# EAGLE design remote_switch (EAGLE 9.6.0)

## Sheet 1 of 2
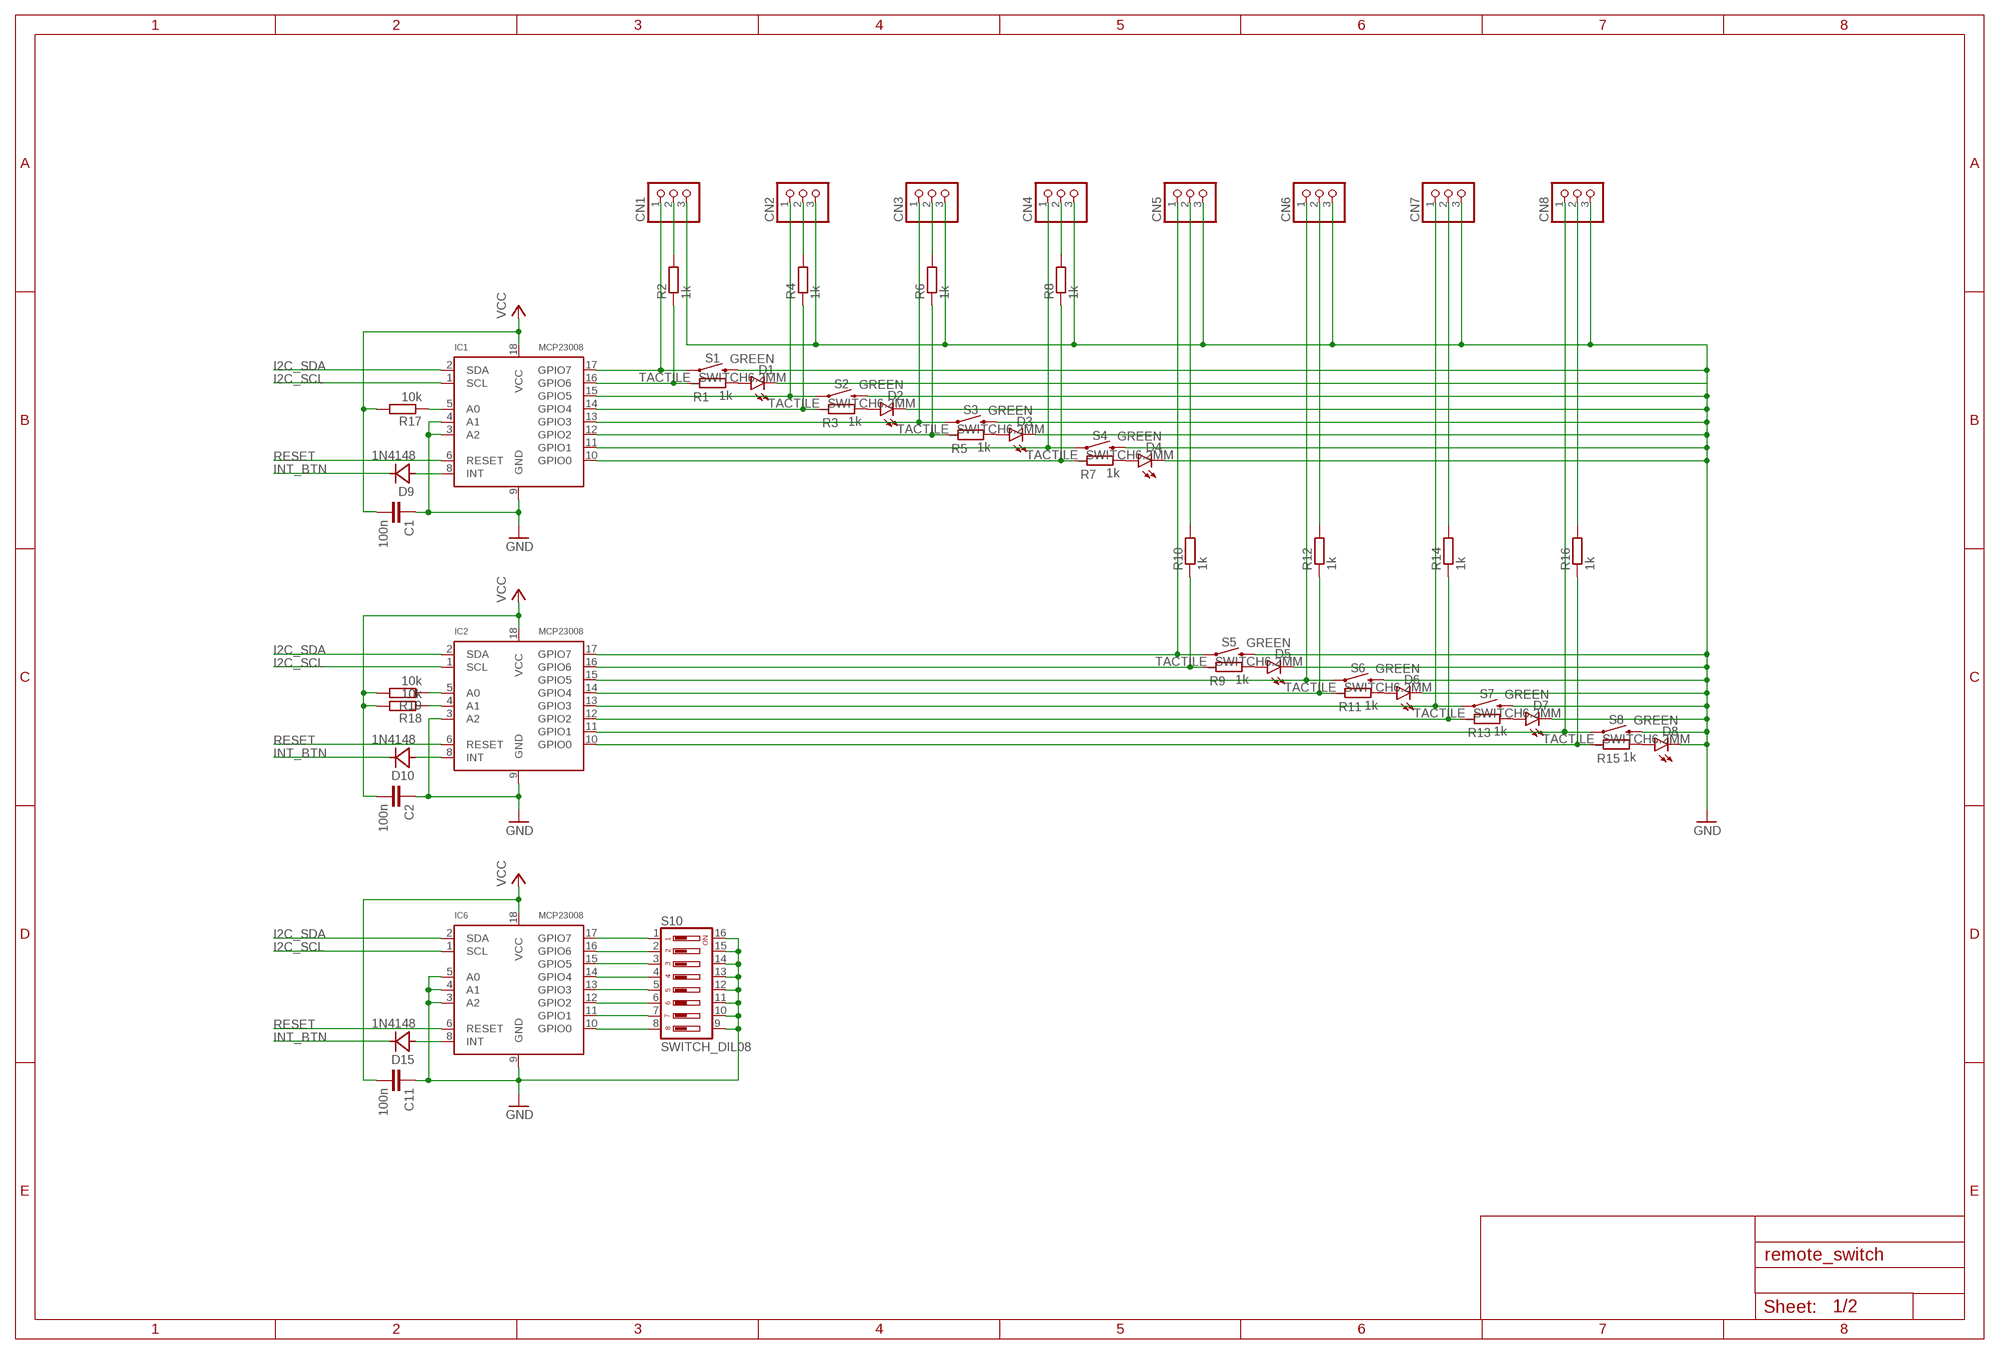
[diagram p0: schematic, sheet 1]

### Parts
C1  100n  CAPACITOR0805  [C0805]
C2  100n  CAPACITOR0805  [C0805]
C11  100n  CAPACITOR0805  [C0805]
CN1  JST_3PIN  [JSTPH3]
CN2  JST_3PIN  [JSTPH3]
CN3  JST_3PIN  [JSTPH3]
CN4  JST_3PIN  [JSTPH3]
CN5  JST_3PIN  [JSTPH3]
CN6  JST_3PIN  [JSTPH3]
CN7  JST_3PIN  [JSTPH3]
CN8  JST_3PIN  [JSTPH3]
D1  GREEN  LED1206  [CHIPLED_1206]
D2  GREEN  LED1206  [CHIPLED_1206]
D3  GREEN  LED1206  [CHIPLED_1206]
D4  GREEN  LED1206  [CHIPLED_1206]
D5  GREEN  LED1206  [CHIPLED_1206]
D6  GREEN  LED1206  [CHIPLED_1206]
D7  GREEN  LED1206  [CHIPLED_1206]
D8  GREEN  LED1206  [CHIPLED_1206]
D9  1N4148  DIODESOD-123  [SOD123]
D10  1N4148  DIODESOD-123  [SOD123]
D15  1N4148  DIODESOD-123  [SOD123]
IC1  MCP23008  MCP23008SO18W  [SO18W]
IC2  MCP23008  MCP23008SO18W  [SO18W]
IC6  MCP23008  MCP23008SO18W  [SO18W]
R1  1k  RESISTOR0805  [R0805]
R2  1k  RESISTOR0805  [R0805]
R3  1k  RESISTOR0805  [R0805]
R4  1k  RESISTOR0805  [R0805]
R5  1k  RESISTOR0805  [R0805]
R6  1k  RESISTOR0805  [R0805]
R7  1k  RESISTOR0805  [R0805]
R8  1k  RESISTOR0805  [R0805]
R9  1k  RESISTOR0805  [R0805]
R10  1k  RESISTOR0805  [R0805]
R11  1k  RESISTOR0805  [R0805]
R12  1k  RESISTOR0805  [R0805]
R13  1k  RESISTOR0805  [R0805]
R14  1k  RESISTOR0805  [R0805]
R15  1k  RESISTOR0805  [R0805]
R16  1k  RESISTOR0805  [R0805]
R17  10k  RESISTOR0805  [R0805]
R18  10k  RESISTOR0805  [R0805]
R19  10k  RESISTOR0805  [R0805]
S1  TACTILE_SWITCH6.2MM  [TACTILE_SWITCH_SMD_6.2MM]
S2  TACTILE_SWITCH6.2MM  [TACTILE_SWITCH_SMD_6.2MM]
S3  TACTILE_SWITCH6.2MM  [TACTILE_SWITCH_SMD_6.2MM]
S4  TACTILE_SWITCH6.2MM  [TACTILE_SWITCH_SMD_6.2MM]
S5  TACTILE_SWITCH6.2MM  [TACTILE_SWITCH_SMD_6.2MM]
S6  TACTILE_SWITCH6.2MM  [TACTILE_SWITCH_SMD_6.2MM]
S7  TACTILE_SWITCH6.2MM  [TACTILE_SWITCH_SMD_6.2MM]
S8  TACTILE_SWITCH6.2MM  [TACTILE_SWITCH_SMD_6.2MM]
S10  SWITCH_DIL08  [CTS-219-08]

### Nets
GND: C1.1 C2.1 C11.1 CN1.3 CN2.3 CN3.3 CN4.3 CN5.3 CN6.3 CN7.3 CN8.3 D1.C D2.C D3.C D4.C D5.C D6.C D7.C D8.C IC1.3(A2) IC1.4(A1) IC1.9(GND) IC2.3(A2) IC2.9(GND) IC6.3(A2) IC6.4(A1) IC6.5(A0) IC6.9(GND) S1.B1 S1.B2 S2.B1 S2.B2 S3.B1 S3.B2 S4.B1 S4.B2 S5.B1 S5.B2 S6.B1 S6.B2 S7.B1 S7.B2 S8.B1 S8.B2 S10.9 S10.10 S10.11 S10.12 S10.13 S10.14 S10.15 S10.16 ; also sheet 2
I2C_SCL: IC1.1(SCL) IC2.1(SCL) IC6.1(SCL) ; also sheet 2
I2C_SDA: IC1.2(SDA) IC2.2(SDA) IC6.2(SDA) ; also sheet 2
INT_BTN: D9.C D10.C D15.C ; also sheet 2
N$2: IC1.5(A0) R17.1
N$7: IC2.5(A0) R19.1
N$8: IC2.4(A1) R18.1
N$9: IC6.17(GPIO7) S10.1
N$10: IC6.16(GPIO6) S10.2
N$11: IC6.15(GPIO5) S10.3
N$12: IC6.14(GPIO4) S10.4
N$13: IC6.13(GPIO3) S10.5
N$14: IC6.12(GPIO2) S10.6
N$15: IC6.11(GPIO1) S10.7
N$25: CN1.1 IC1.17(GPIO7) S1.A1 S1.A2
N$26: CN2.1 IC1.15(GPIO5) S2.A1 S2.A2
N$27: CN3.1 IC1.13(GPIO3) S3.A1 S3.A2
N$28: CN4.1 IC1.11(GPIO1) S4.A1 S4.A2
N$29: CN5.1 IC2.17(GPIO7) S5.A1 S5.A2
N$30: CN6.1 IC2.15(GPIO5) S6.A1 S6.A2
N$31: CN7.1 IC2.13(GPIO3) S7.A1 S7.A2
N$32: CN8.1 IC2.11(GPIO1) S8.A1 S8.A2
N$33: D1.A R1.2
N$34: D2.A R3.2
N$35: D3.A R5.2
N$36: D4.A R7.2
N$37: D5.A R9.2
N$38: D6.A R11.2
N$39: D7.A R13.2
N$40: D8.A R15.2
N$41: CN1.2 R2.2
N$42: IC1.16(GPIO6) R1.1 R2.1
N$43: CN2.2 R4.2
N$44: CN3.2 R6.2
N$45: CN4.2 R8.2
N$46: CN5.2 R10.2
N$47: CN6.2 R12.2
N$48: CN7.2 R14.2
N$49: CN8.2 R16.2
N$50: IC1.14(GPIO4) R3.1 R4.1
N$51: IC1.12(GPIO2) R5.1 R6.1
N$52: IC1.10(GPIO0) R7.1 R8.1
N$53: IC2.16(GPIO6) R9.1 R10.1
N$54: IC2.14(GPIO4) R11.1 R12.1
N$55: IC2.12(GPIO2) R13.1 R14.1
N$56: IC2.10(GPIO0) R15.1 R16.1
N$57: IC6.10(GPIO0) S10.8
N$58: D10.A IC2.8(INT)
N$122: D9.A IC1.8(INT)
N$123: D15.A IC6.8(INT)
RESET: IC1.6(RESET) IC2.6(RESET) IC6.6(RESET) ; also sheet 2
VCC: C1.2 C2.2 C11.2 IC1.18(VCC) IC2.18(VCC) IC6.18(VCC) R17.2 R18.2 R19.2 ; also sheet 2

## Sheet 2 of 2
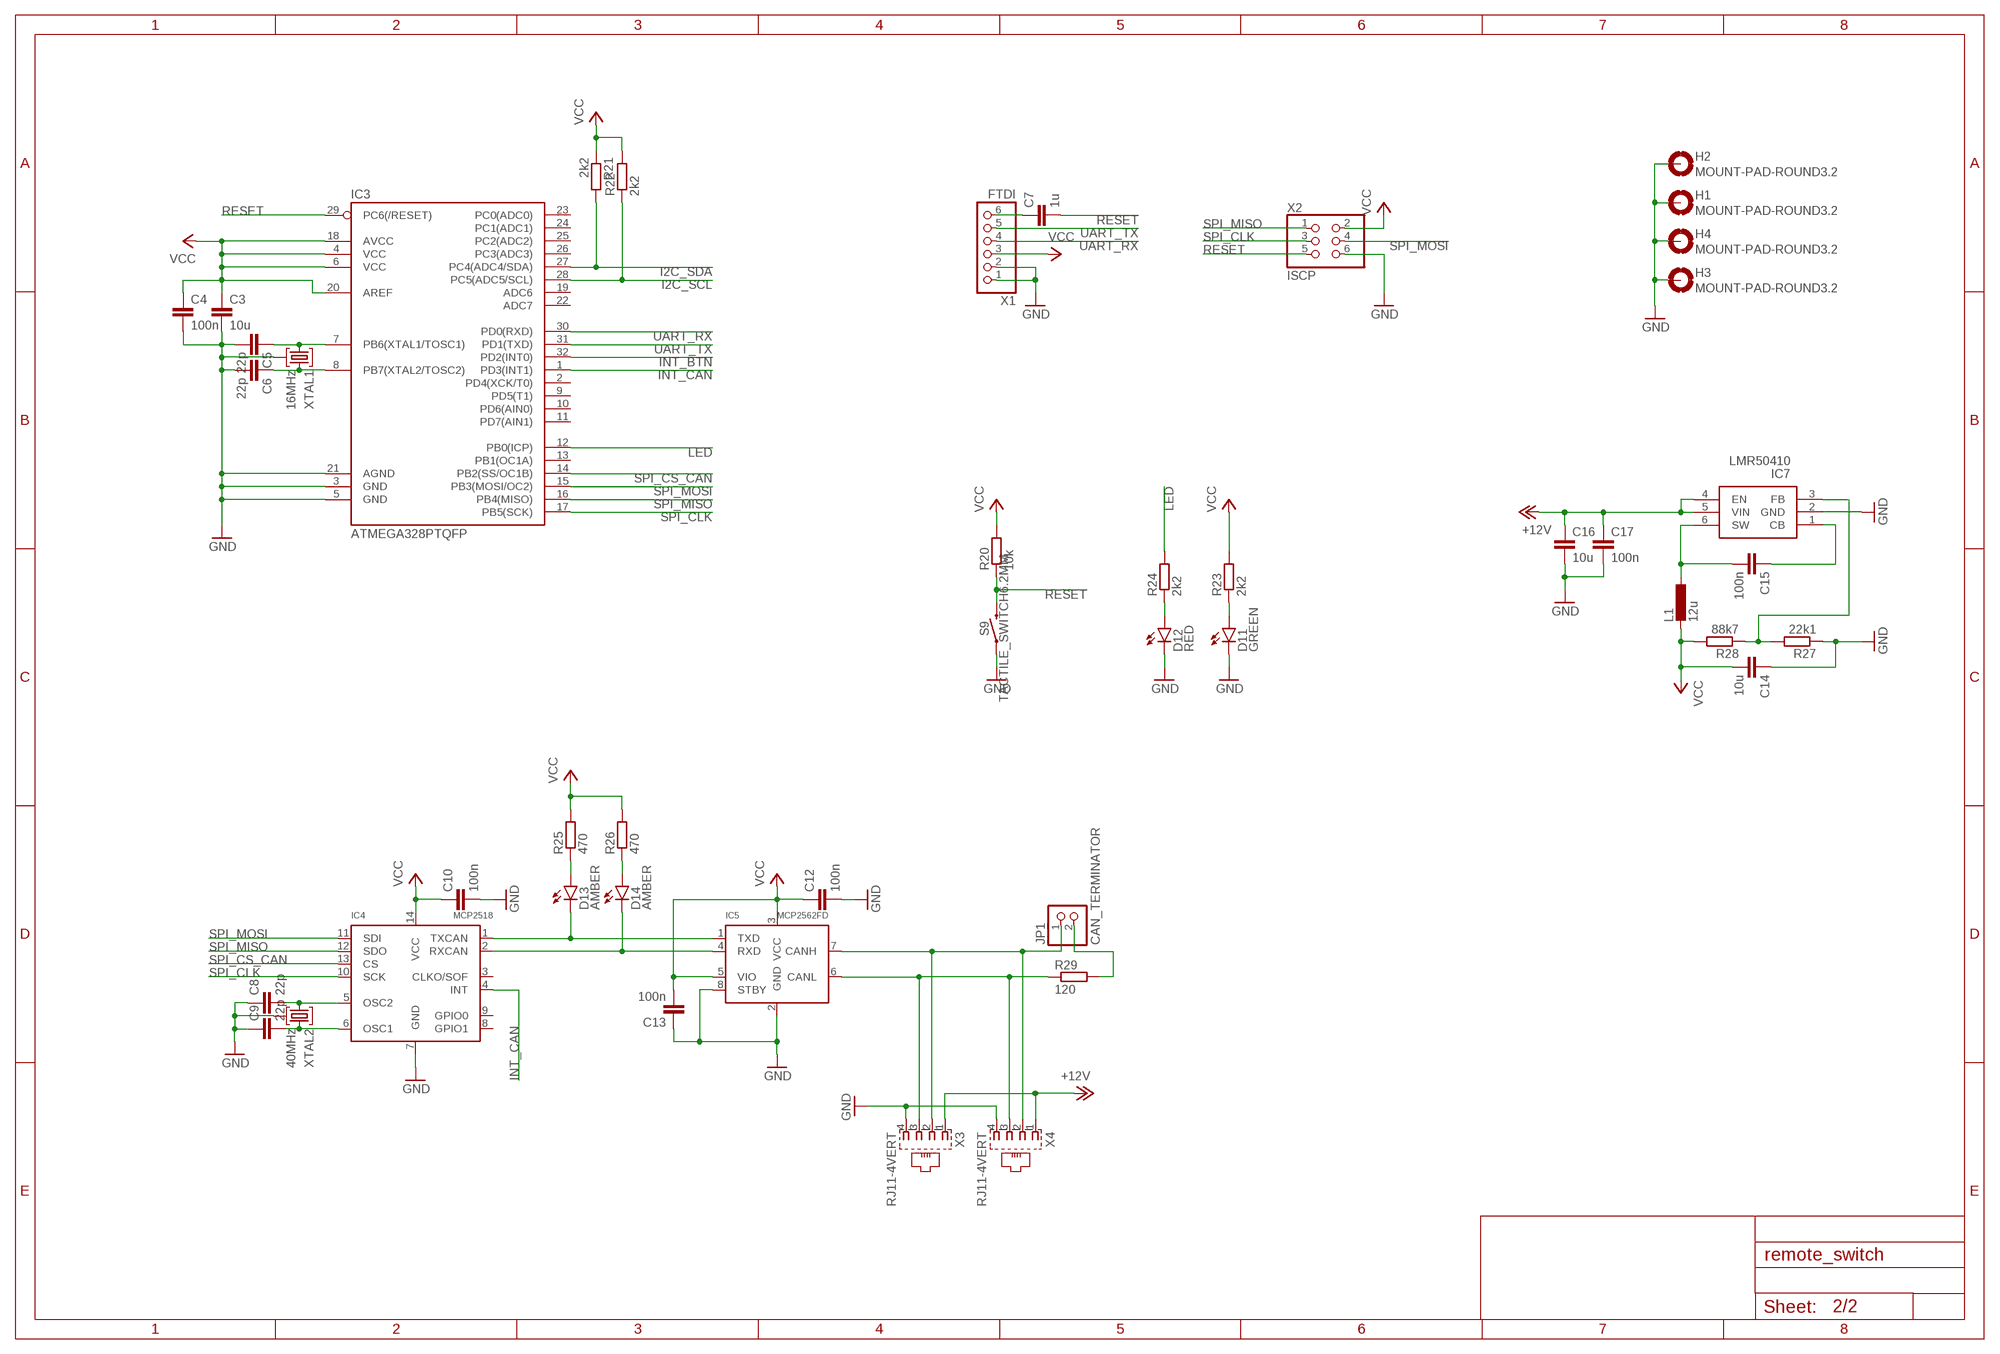
[diagram p1: schematic, sheet 2]

### Parts
C3  10u  CAPACITOR1206  [C1206]
C4  100n  CAPACITOR0805  [C0805]
C5  22p  CAPACITOR0805  [C0805]
C6  22p  CAPACITOR0805  [C0805]
C7  1u  CAPACITOR0805  [C0805]
C8  22p  CAPACITOR0805  [C0805]
C9  22p  CAPACITOR0805  [C0805]
C10  100n  CAPACITOR0805  [C0805]
C12  100n  CAPACITOR0805  [C0805]
C13  100n  CAPACITOR0805  [C0805]
C14  10u  CAPACITOR1206  [C1206]
C15  100n  CAPACITOR0805  [C0805]
C16  10u  CAPACITOR1206  [C1206]
C17  100n  CAPACITOR0805  [C0805]
D11  GREEN  LED1206  [CHIPLED_1206]
D12  RED  LED1206  [CHIPLED_1206]
D13  AMBER  LED1206  [CHIPLED_1206]
D14  AMBER  LED1206  [CHIPLED_1206]
H1  MOUNT-PAD-ROUND3.2  [3,2-PAD]
H2  MOUNT-PAD-ROUND3.2  [3,2-PAD]
H3  MOUNT-PAD-ROUND3.2  [3,2-PAD]
H4  MOUNT-PAD-ROUND3.2  [3,2-PAD]
IC3  ATMEGA328PTQFP  [TQFP32_0.8MM_7X7MM]
IC4  MCP2518  MCP2518FDSO14  [SO14]
IC5  MCP2562FD  MCP2562FDSO08  [SO08]
IC7  LMR50410  [SOT23-6]
JP1  CAN_TERMINATOR  PINHD-1X2  [1X02]
L1  12u  INDUCTOR7.3MM  [L_7.3MM]
R20  10k  RESISTOR0805  [R0805]
R21  2k2  RESISTOR0805  [R0805]
R22  2k2  RESISTOR0805  [R0805]
R23  2k2  RESISTOR0805  [R0805]
R24  2k2  RESISTOR0805  [R0805]
R25  470  RESISTOR0805  [R0805]
R26  470  RESISTOR0805  [R0805]
R27  22k1  RESISTOR0805  [R0805]
R28  88k7  RESISTOR0805  [R0805]
R29  120  RESISTOR0805  [R0805]
S9  TACTILE_SWITCH6.2MM  [TACTILE_SWITCH_SMD_6.2MM]
X1  FTDI  PINHD-1X6  [1X06]
X2  ISCP  PINHD-2X3  [2X03]
X3  RJ11-4VERT  [RJ11-4_VERT]
X4  RJ11-4VERT  [RJ11-4_VERT]
XTAL1  16MHz  CRYSTAL_GND5X3.2  [XTAL_5.0X3.2_4]
XTAL2  40MHz  CRYSTAL_GND5X3.2  [XTAL_5.0X3.2_4]

### Nets
+12V: C16.1 C17.1 IC7.4(EN) IC7.5(VIN) X3.1 X4.1
GND: C3.2 C4.2 C5.2 C6.2 C8.1 C9.1 C10.2 C12.2 C13.1 C14.1 C16.2 C17.2 D11.C D12.C H1.B3,2(MOUNT) H1.P$1(MOUNT) H1.P$2(MOUNT) H1.P$3(MOUNT) H1.P$4(MOUNT) H1.P$5(MOUNT) H1.P$6(MOUNT) H1.P$7(MOUNT) H1.P$8(MOUNT) H2.B3,2(MOUNT) H2.P$1(MOUNT) H2.P$2(MOUNT) H2.P$3(MOUNT) H2.P$4(MOUNT) H2.P$5(MOUNT) H2.P$6(MOUNT) H2.P$7(MOUNT) H2.P$8(MOUNT) H3.B3,2(MOUNT) H3.P$1(MOUNT) H3.P$2(MOUNT) H3.P$3(MOUNT) H3.P$4(MOUNT) H3.P$5(MOUNT) H3.P$6(MOUNT) H3.P$7(MOUNT) H3.P$8(MOUNT) H4.B3,2(MOUNT) H4.P$1(MOUNT) H4.P$2(MOUNT) H4.P$3(MOUNT) H4.P$4(MOUNT) H4.P$5(MOUNT) H4.P$6(MOUNT) H4.P$7(MOUNT) H4.P$8(MOUNT) IC3.3(GND) IC3.5(GND) IC3.21(AGND) IC4.7(GND) IC5.2(GND) IC5.8(STBY) IC7.2(GND) R27.1 S9.A1 S9.A2 X1.1 X1.2 X2.6 X3.4 X4.4 XTAL1.2 XTAL1.4 XTAL2.2 XTAL2.4 ; also sheet 1
I2C_SCL: IC3.28(PC5(ADC5/SCL)) R22.1 ; also sheet 1
I2C_SDA: IC3.27(PC4(ADC4/SDA)) R21.2 ; also sheet 1
INT_BTN: IC3.32(PD2(INT0)) ; also sheet 1
INT_CAN: IC3.1(PD3(INT1)) IC4.4(INT)
LED: IC3.12(PB0(ICP)) R24.2
N$1: D12.A R24.1
N$3: C5.1 IC3.7(PB6(XTAL1/TOSC1)) XTAL1.1
N$4: C6.1 IC3.8(PB7(XTAL2/TOSC2)) XTAL1.3
N$5: D11.A R23.1
N$6: C7.1 X1.6
N$16: IC5.6(CANL) R29.1 X3.3 X4.3
N$17: IC5.7(CANH) JP1.1 X3.2 X4.2
N$18: D13.C IC4.1(TXCAN) IC5.1(TXD)
N$19: D14.C IC4.2(RXCAN) IC5.4(RXD)
N$20: C8.2 IC4.5(OSC2) XTAL2.1
N$21: C9.2 IC4.6(OSC1) XTAL2.3
N$22: D13.A R25.1
N$23: D14.A R26.1
N$24: JP1.2 R29.2
N$125: C15.2 IC7.6(SW) L1.1
N$126: C15.1 IC7.1(CB)
N$127: IC7.3(FB) R27.2 R28.1
RESET: C7.2 IC3.29(PC6(/RESET)) R20.1 S9.B1 S9.B2 X2.5 ; also sheet 1
SPI_CLK: IC3.17(PB5(SCK)) IC4.10(SCK) X2.3
SPI_CS_CAN: IC3.14(PB2(SS/OC1B)) IC4.13(CS)
SPI_MISO: IC3.16(PB4(MISO)) IC4.12(SDO) X2.1
SPI_MOSI: IC3.15(PB3(MOSI/OC2)) IC4.11(SDI) X2.4
UART_RX: IC3.30(PD0(RXD)) X1.4
UART_TX: IC3.31(PD1(TXD)) X1.5
VCC: C3.1 C4.1 C10.1 C12.1 C13.2 C14.2 IC3.4(VCC) IC3.6(VCC) IC3.18(AVCC) IC3.20(AREF) IC4.14(VCC) IC5.3(VCC) IC5.5(VIO) L1.2 R20.2 R21.1 R22.2 R23.2 R25.2 R26.2 R28.2 X1.3 X2.2 ; also sheet 1
Unconnected: IC3.2(PD4(XCK/T0)) IC3.9(PD5(T1)) IC3.10(PD6(AIN0)) IC3.11(PD7(AIN1)) IC3.13(PB1(OC1A)) IC3.19(ADC6) IC3.22(ADC7) IC3.23(PC0(ADC0)) IC3.24(PC1(ADC1)) IC3.25(PC2(ADC2)) IC3.26(PC3(ADC3)) IC4.3(CLKO/SOF) IC4.8(GPIO1) IC4.9(GPIO0)

## Library data of the parts
C1-C17 = SMD:CAPACITOR
CN1-CN8 = SMD:JST_3PIN
D1-D8 D11-D14 = SMD:LED
D9 D10 D15 = SMD:DIODE
H1-H4 = THT:MOUNT-PAD-ROUND: MOUNTING PAD, round
IC1 IC2 IC6 = SMD:MCP23008
IC3 = SMD:ATMEGA328P
IC4 = SMD:MCP2518FD
IC5 = SMD:MCP2562FD
IC7 = SMD:LMR50410
JP1 = THT:PINHD-1X2: PIN HEADER
L1 = SMD:INDUCTOR
R1-R29 = SMD:RESISTOR
S1-S9 = SMD:TACTILE_SWITCH
S10 = SMD:SWITCH_DIL08: Surface Mount DIP Switch Series 219 SMT CTS Electronic Components Sourc: www.ctscorp.com; OC_FARNELL: unknown; OC_NEWARK: unknown
X1 = THT:PINHD-1X6: PIN HEADER
X2 = THT:PINHD-2X3: PIN HEADER
X3 X4 = THT:RJ11-4
XTAL1 XTAL2 = SMD:CRYSTAL_GND

## Board
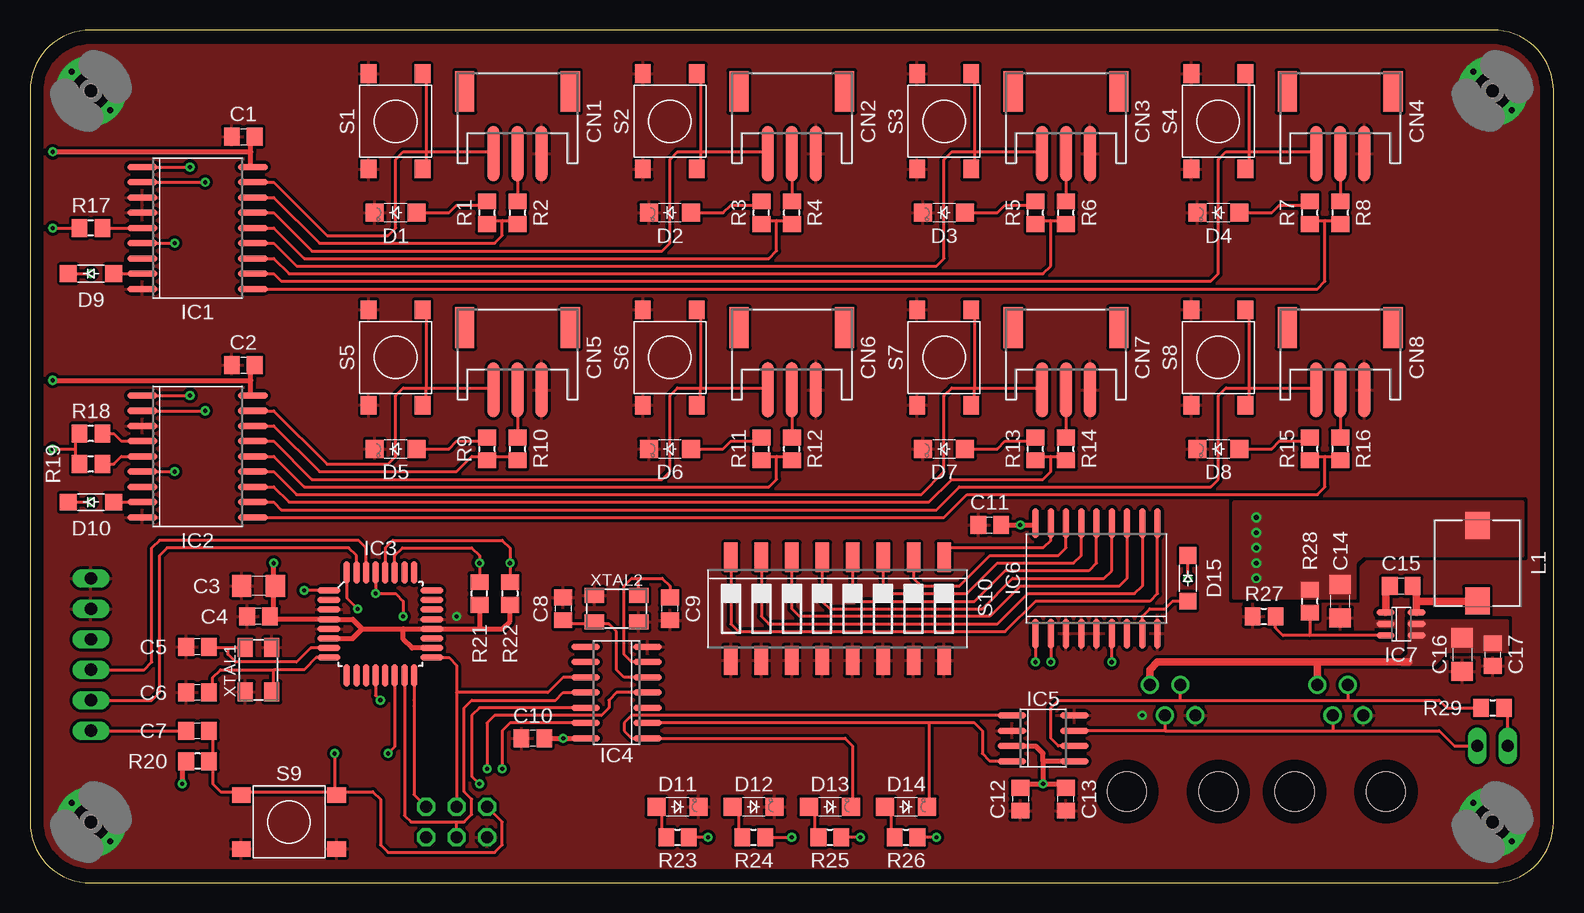
[diagram p2: board, top side]
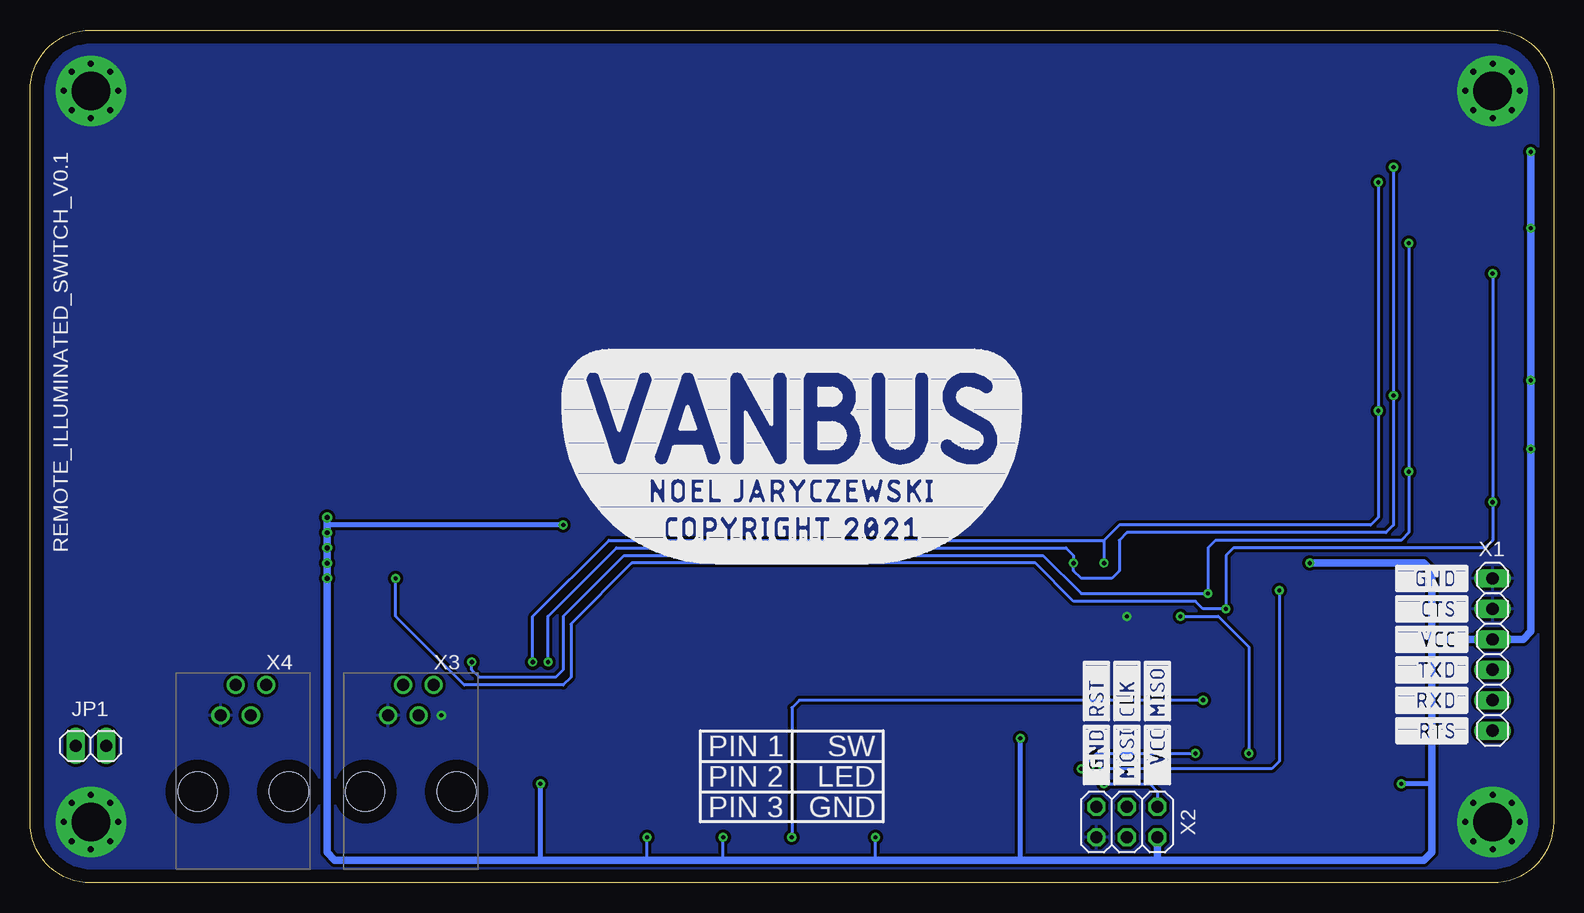
[diagram p3: board, bottom side, seen from below]

Size 127 x 71.12 mm. Coordinates in mm from the lower left corner, seen from the top.
Outline: 0,66.04 0,5.08 arc90 5.08,0 121.92,0 arc90 127,5.08 127,66.04 arc90 121.92,71.12 5.08,71.12 arc90 0,66.04
Copper layers (1*16): Top 0.035mm / dielectric 1.5mm / Bottom 0.035mm
Design rules "default *": minimum track width 6mil, minimum drill 0.35mm, track to track 8mil, track to pad 8mil, pad to pad 8mil, via to via 8mil, smd to smd 8mil, copper to edge 40mil, drill to drill 6mil, minimum pad ring 10mil, minimum via ring 8mil, stop-mask expansion 4mil, vias tented up to drill 16mil, thermal gap 10mil

### Footprints (pad centres in the part's own frame; a part is rotated, then mirrored left to right if it is on the bottom)
C0805 = smd 1.3 x 1.5: 1 -0.95,0; 2 0.95,0
C1206 = smd 1.6 x 1.8: 1 -1.4,0; 2 1.4,0
JSTPH3 = smd 1 x 4.6: 1 -2,-2.7; 2 0,-2.7; 3 2,-2.7 | smd 1.6 x 3.4: NC1 -4.4,2.5; NC2 4.4,2.5
CHIPLED_1206 = smd 1.5 x 1.5: A 0,-1.75; C 0,1.75
SOD123 = smd 1.4 x 1.4: A 1.9,0; C -1.9,0
3,2-PAD = drill 3.2 pad 5.842: B3,2 0,0 | drill 0.5: P$1 0,2.261; P$2 0,-2.261; P$3 2.261,0; P$4 -2.261,0; P$5 -1.598,1.598; P$6 1.598,1.598; P$7 -1.598,-1.598; P$8 1.598,-1.598
SO18W = smd 0.559 x 2.515: 1 -5.08,-4.6; 2 -3.81,-4.6; 3 -2.54,-4.6; 4 -1.27,-4.6; 5 0,-4.6; 6 1.27,-4.6; 7 2.54,-4.6; 8 3.81,-4.6; 9 5.08,-4.6; 10 5.08,4.6; 11 3.81,4.6; 12 2.54,4.6; 13 1.27,4.6; 14 0,4.6; 15 -1.27,4.6; 16 -2.54,4.6; 17 -3.81,4.6; 18 -5.08,4.6
TQFP32_0.8MM_7X7MM = smd 1.905 x 0.559: 1 -4.293,2.8; 2 -4.293,2; 3 -4.293,1.2; 4 -4.293,0.4; 5 -4.293,-0.4; 6 -4.293,-1.2; 7 -4.293,-2; 8 -4.293,-2.8; 17 4.293,-2.8; 18 4.293,-2; 19 4.293,-1.2; 20 4.293,-0.4; 21 4.293,0.4; 22 4.293,1.2; 23 4.293,2; 24 4.293,2.8 | smd 0.559 x 1.905: 9 -2.8,-4.293; 10 -2,-4.293; 11 -1.2,-4.293; 12 -0.4,-4.293; 13 0.4,-4.293; 14 1.2,-4.293; 15 2,-4.293; 16 2.8,-4.293; 25 2.8,4.293; 26 2,4.293; 27 1.2,4.293; 28 0.4,4.293; 29 -0.4,4.293; 30 -1.2,4.293; 31 -2,4.293; 32 -2.8,4.293
SO14 = smd 0.559 x 2.388: 1 -3.81,-2.6; 2 -2.54,-2.6; 3 -1.27,-2.6; 4 0,-2.6; 5 1.27,-2.6; 6 2.54,-2.6; 7 3.81,-2.6; 8 3.81,2.6; 9 2.54,2.6; 10 1.27,2.6; 11 0,2.6; 12 -1.27,2.6; 13 -2.54,2.6; 14 -3.81,2.6
SO08 = smd 0.559 x 2.388: 1 -1.905,-2.6; 2 -0.635,-2.6; 3 0.635,-2.6; 4 1.905,-2.6; 5 1.905,2.6; 6 0.635,2.6; 7 -0.635,2.6; 8 -1.905,2.6
SOT23-6 = smd 0.559 x 1.524: 1 0.95,1.3; 2 0,1.3; 3 -0.95,1.3; 4 -0.95,-1.3; 5 0,-1.3; 6 0.95,-1.3
1X02 = drill 1.016 long: 1 -1.27,0; 2 1.27,0
L_7.3MM = smd 2.25 x 2.05: 1 -3.15,0; 2 3.15,0
R0805 = smd 1.3 x 1.5: 1 -0.95,0; 2 0.95,0
TACTILE_SWITCH_SMD_6.2MM = smd 1.55 x 1.3: A1 -3.975,-2.25; A2 3.975,-2.25; B1 -3.975,2.25; B2 3.975,2.25
CTS-219-08 = smd 1.13 x 2.44: 1 -8.89,-4.3; 2 -6.35,-4.3; 3 -3.81,-4.3; 4 -1.27,-4.3; 5 1.27,-4.3; 6 3.81,-4.3; 7 6.35,-4.3; 8 8.89,-4.3; 9 8.89,4.3; 10 6.35,4.3; 11 3.81,4.3; 12 1.27,4.3; 13 -1.27,4.3; 14 -3.81,4.3; 15 -6.35,4.3; 16 -8.89,4.3
1X06 = drill 1.016 long: 1 -6.35,0; 2 -3.81,0; 3 -1.27,0; 4 1.27,0; 5 3.81,0; 6 6.35,0
2X03 = drill 1.016 octagon: 1 -2.54,-1.27; 2 -2.54,1.27; 3 0,-1.27; 4 0,1.27; 5 2.54,-1.27; 6 2.54,1.27
RJ11-4_VERT = drill 1: 1 -1.905,-8.89; 2 -0.635,-6.35; 3 0.635,-8.89; 4 1.905,-6.35 | hole 3.25: -3.81,0; 3.81,0
XTAL_5.0X3.2_4 = smd 1.6 x 1.25: 1 -1.85,-1.1; 2 1.85,-1.1; 3 1.85,1.1; 4 -1.85,1.1

### Placement (x,y rotation side)
C1  17.78,62.23 0 top
C2  17.78,43.18 0 top
C3  19.05,24.77 180 top
C4  19.05,22.23 180 top
C5  13.97,19.68 180 top
C6  13.97,15.88 180 top
C7  13.97,12.7 0 top
C8  44.45,22.86 270 top
C9  53.34,22.86 90 top
C10  41.91,12.06 180 top
C11  80.01,29.84 0 top
C12  82.55,6.99 270 top
C13  86.36,6.99 90 top
C14  109.22,23.5 90 top
C15  114.3,24.77 0 top
C16  119.38,19.05 270 top
C17  121.92,19.05 270 top
CN1  40.64,63.5 0 top
CN2  63.5,63.5 0 top
CN3  86.36,63.5 0 top
CN4  109.22,63.5 0 top
CN5  40.64,43.81 0 top
CN6  63.5,43.81 0 top
CN7  86.36,43.81 0 top
CN8  109.22,43.81 0 top
D1  30.48,55.88 90 top
D2  53.34,55.88 90 top
D3  76.2,55.88 90 top
D4  99.06,55.88 90 top
D5  30.48,36.2 90 top
D6  53.34,36.2 90 top
D7  76.2,36.2 90 top
D8  99.06,36.2 90 top
D9  5.08,50.8 0 top
D10  5.08,31.75 0 top
D11  53.98,6.35 270 top
D12  60.33,6.35 270 top
D13  66.67,6.35 270 top
D14  73.03,6.35 270 top
D15  96.52,25.4 270 top
H1  5.08,66.04 0 top
H2  121.92,66.04 0 top
H3  5.08,5.08 0 top
H4  121.92,5.08 0 top
IC1  13.97,54.61 270 top
IC2  13.97,35.56 270 top
IC3  29.21,21.59 0 top
IC4  48.9,15.88 90 top
IC5  84.45,12.06 270 top
IC6  88.9,25.4 0 top
IC7  114.3,21.59 90 top
JP1  121.92,11.43 180 bottom
L1  120.65,26.67 90 top
R1  38.1,55.88 90 top
R2  40.64,55.88 90 top
R3  60.96,55.88 90 top
R4  63.5,55.88 90 top
R5  83.82,55.88 90 top
R6  86.36,55.88 90 top
R7  106.68,55.88 90 top
R8  109.22,55.88 90 top
R9  38.1,36.2 90 top
R10  40.64,36.2 90 top
R11  60.96,36.2 90 top
R12  63.5,36.2 90 top
R13  83.82,36.2 90 top
R14  86.36,36.2 90 top
R15  106.68,36.2 90 top
R16  109.22,36.2 90 top
R17  5.08,54.61 180 top
R18  5.08,37.47 180 top
R19  5.08,34.92 180 top
R20  13.97,10.16 180 top
R21  37.47,24.13 90 top
R22  40.01,24.13 270 top
R23  53.98,3.81 0 top
R24  60.33,3.81 0 top
R25  66.67,3.81 0 top
R26  73.03,3.81 0 top
R27  102.87,22.23 0 top
R28  106.68,23.5 90 top
R29  121.92,14.61 0 top
S1  30.48,63.5 90 top
S2  53.34,63.5 90 top
S3  76.2,63.5 90 top
S4  99.06,63.5 90 top
S5  30.48,43.81 90 top
S6  53.34,43.81 90 top
S7  76.2,43.81 90 top
S8  99.06,43.81 90 top
S9  21.59,5.08 0 top
S10  67.31,22.86 180 top
X1  5.08,19.05 270 bottom
X2  35.56,5.08 180 bottom
X3  95.25,7.62 180 bottom
X4  109.22,7.62 180 bottom
XTAL1  19.05,17.78 270 top
XTAL2  48.9,22.86 0 top

### Tracks (layer width: path | path; a pad name or v marks a point on that pad's centre or on a via)
+12V
  Top 0.61: X3.1 93.34,17.78 93.98,18.41 107.31,18.41 | X4.1 107.31,18.41 | C17.1 122.23,19.68 | 107.31,18.41 114.94,18.41
  pour Top (isolate 0.254, no thermals): 114.94,21.84 114.94,19.05 114.3,18.41 114.3,18.24 117.09,18.24 118.16,19.3 123.19,19.3 123.19,21.84
GND  (via drill 0.35)
  other vias: 92.71,13.97 35.56,22.23
  pour Top (isolate 0.254, rank 2): 125.73,66.04 125.73,5.08 arc-90 121.92,1.27 5.08,1.27 arc-90 1.27,5.08 1.27,66.04 arc-90 5.08,69.85 121.92,69.85 arc-90
  pour Bottom (isolate 0.254, rank 2): 1.27,5.08 1.27,66.04 arc-90 5.08,69.85 121.92,69.85 arc-90 125.73,66.04 125.73,5.08 arc-90 121.92,1.27 5.08,1.27 arc-90
  pour Top (no thermals): 111.76,21.84 114.3,21.84 114.3,21.34 111.76,21.34
I2C_SCL  (via drill 0.35)
  Top 0.254: R22.1 v40.01,26.67 40.01,27.94 39.37,28.57 30.25,28.57 29.61,27.94 IC3.28 | IC6.1 v83.82,18.41 | IC1.1 v13.34,59.69 | IC2.1 v13.34,40.64
  Bottom 0.254: v83.82,18.41 83.82,22.23 78.11,27.94 40.64,27.94 40.01,27.3 v40.01,26.67 40.01,26.04 39.37,25.4 36.83,25.4 36.2,26.04 36.2,28.57 35.56,29.21 13.97,29.21 13.34,29.84 v13.34,40.64 v13.34,59.69
I2C_SDA  (via drill 0.35)
  Top 0.254: IC3.27 30.41,27.3 31.05,27.94 36.83,27.94 37.47,27.3 v37.47,26.67 R21.2 | IC6.2 v85.09,18.41 | IC1.2 v14.61,58.42 | IC2.2 v14.61,39.37
  Bottom 0.254: v85.09,18.41 85.09,22.23 78.74,28.57 37.47,28.57 | 37.47,28.57 v37.47,26.67 | v14.61,58.42 v14.61,39.37 14.61,30.48 15.24,29.84 36.2,29.84 37.47,28.57
INT_BTN  (via drill 0.35)
  Top 0.254: v96.52,25.4 D15.C | D9.C v5.08,50.8 | D10.C v5.08,31.75 | IC3.32 26.41,23.75 v27.3,22.86
  Bottom 0.254: v96.52,25.4 96.52,22.23 90.81,16.51 82.55,16.51 81.92,17.14 81.92,21.59 76.83,26.67 43.18,26.67 40.01,23.5 29.84,23.5 29.21,22.86 v27.3,22.86 27.3,27.3 26.67,27.94 5.71,27.94 5.08,28.57 v5.08,31.75 v5.08,50.8
INT_CAN  (via drill 0.35)
  Top 0.254: IC3.1 v22.86,24.39 | IC4.4 48.9,15.88 48.26,15.24 48.26,14.61 47.62,13.97 38.73,13.97 38.1,13.34 v38.1,9.53
  Bottom 0.254: v22.86,24.39 22.86,10.16 23.5,9.53 v38.1,9.53
LED  (via drill 0.35)
  Top 0.254: IC3.12 28.81,15.64 v29.21,15.24 | R24.2 v63.5,3.81
  Bottom 0.254: v29.21,15.24 62.87,15.24 63.5,14.61 v63.5,3.81
N$1
  Top 0.254: D12.A 59.05,5.87 59.05,4.13 R24.1
N$2
  Top 0.254: R17.1 IC1.5
N$3
  Top 0.254: C5.1 14.97,19.63 16.51,19.63 | 16.51,19.63 XTAL1.1 | IC3.7 23.4,19.59 22.23,18.41 17.14,18.41 16.51,19.05 16.51,19.63
N$4
  Top 0.254: C6.1 14.92,16.19 15.24,16.51 15.24,17.14 15.88,17.78 20.32,17.78 | XTAL1.3 20.15,16.34 20.32,16.51 20.32,17.78 | IC3.8 23.87,18.79 22.86,17.78 20.32,17.78
N$5
  Top 0.254: R23.1 52.7,4.13 52.7,5.87 D11.A
N$6
  Top 0.254: X1.6 C7.1
N$7
  Top 0.254: R19.1 6.99,34.92 7.62,35.56 IC2.5
N$8
  Top 0.254: R18.1 6.99,37.47 7.62,36.83 IC2.4
N$9
  Top 0.254: IC6.17 85.09,28.57 84.45,27.94 76.2,27.94 S10.1
N$10
  Top 0.254: S10.2 73.66,25.4 74.3,24.77 77.47,24.77 80.01,27.3 85.72,27.3 86.36,27.94 IC6.16
N$11
  Top 0.254: S10.3 71.12,24.77 71.75,24.13 78.11,24.13 80.64,26.67 87,26.67 87.63,27.3 IC6.15
N$12
  Top 0.254: S10.4 68.58,24.13 69.22,23.5 78.74,23.5 81.28,26.04 88.27,26.04 88.9,26.67 IC6.14
N$13
  Top 0.254: S10.5 66.04,23.5 66.67,22.86 79.38,22.86 81.92,25.4 89.53,25.4 90.17,26.04 IC6.13
N$14
  Top 0.254: IC6.12 91.44,25.4 90.81,24.77 82.55,24.77 80.01,22.23 64.14,22.23 63.5,22.86 S10.6
N$15
  Top 0.254: IC6.11 92.71,24.77 92.08,24.13 83.19,24.13 80.64,21.59 61.59,21.59 60.96,22.23 S10.7
N$16
  Top 0.254: 95.89,15.24 109.86,15.24 | X4.3 109.86,15.24 | IC5.6 85.72,11.43 85.09,12.06 85.09,14.61 85.72,15.24 95.89,15.24 | 95.89,15.24 X3.3 | 109.86,15.24 117.47,15.24 118.11,14.61 R29.1
N$17
  Top 0.254: X4.2 108.58,12.7 | 108.58,12.7 117.47,12.7 118.75,11.43 JP1.1 | X3.2 94.61,12.7 | 94.61,12.7 108.58,12.7 | 94.61,12.7 IC5.7
N$18
  Top 0.254: IC5.1 50.16,13.97 49.53,13.34 49.53,12.7 50.16,12.06 IC4.1 67.94,12.06 68.58,11.43 68.58,6.5 D13.C
N$19
  Top 0.254: IC5.4 80.01,10.16 79.38,10.79 79.38,12.7 78.74,13.34 74.93,13.34 | 74.93,13.34 IC4.2 | D14.C 74.93,6.5 74.93,13.34
N$20
  Top 0.254: IC4.5 49.53,17.14 48.9,17.78 48.9,20.95 48.26,21.59 47.22,21.59 XTAL2.1 46.88,21.59 44.77,21.59 C8.2
N$21
  Top 0.254: IC4.6 50.16,18.41 49.53,19.05 49.53,24.77 50.16,25.4 50.8,25.4 | 50.8,25.4 52.7,25.4 53.34,24.77 C9.2 | XTAL2.3 50.74,25.34 50.8,25.4
N$22
  Top 0.254: D13.A 65.41,5.87 65.41,4.13 R25.1
N$23
  Top 0.254: D14.A 71.75,5.87 71.75,4.13 R26.1
N$24
  Top 0.254: R29.2 123.19,14.29 JP1.2
N$25
  Top 0.254: S1.A2 33.02,67.19 33.02,60.96 | S1.A1 33.02,59.81 33.02,60.96 | CN1.1 38.48,60.96 33.02,60.96 | IC1.17 20.32,58.42 24.77,53.98 29.84,53.98 30.48,54.61 30.48,60.33 31.11,60.96 33.02,60.96
N$26
  Top 0.254: S2.A2 55.88,67.19 55.88,60.96 | S2.A1 55.88,59.81 55.88,60.96 | 55.88,60.96 61.34,60.96 CN2.1 | IC1.15 20.32,55.88 23.52,52.68 52.68,52.68 53.34,53.34 53.34,60.33 53.98,60.96 55.88,60.96
N$27
  Top 0.254: S3.A2 78.74,67.19 78.74,60.96 | S3.A1 78.74,59.81 78.74,60.96 | CN3.1 84.2,60.96 78.74,60.96 | IC1.13 20.32,53.34 22.23,51.44 75.56,51.44 76.2,52.07 76.2,60.33 76.83,60.96 78.74,60.96
N$28
  Top 0.254: S4.A2 101.6,67.19 101.6,60.96 | S4.A1 101.6,59.81 101.6,60.96 | CN4.1 107.06,60.96 101.6,60.96 | IC1.11 20.32,50.8 20.95,50.16 98.42,50.16 99.06,50.8 99.06,60.33 99.69,60.96 101.6,60.96
N$29
  Top 0.254: IC2.17 20.32,39.37 24.77,34.92 29.84,34.92 30.48,35.56 30.48,40.64 31.11,41.27 33.02,41.27 | CN5.1 38.48,41.27 33.02,41.27 | S5.A1 33.03,40.14 33.03,41.26 | 33.03,41.26 33.02,41.27 | S5.A2 33.03,47.49 33.03,41.26
N$30
  Top 0.254: IC2.15 20.32,36.83 23.5,33.66 52.7,33.66 53.34,34.29 53.34,40.64 53.98,41.27 55.88,41.27 | CN6.1 61.34,41.27 55.88,41.27 | S6.A1 55.76,40.01 55.88,40.01 55.88,41.27 | S6.A2 55.88,47.5 55.88,41.27
N$31
  Top 0.254: IC2.13 20.32,34.29 22.23,32.38 74.3,32.38 76.2,34.29 76.2,40.64 76.83,41.27 78.74,41.27 | 78.74,41.27 84.2,41.27 CN7.1 | S7.A1 78.61,40.01 78.74,40.01 78.74,41.27 | S7.A2 78.74,47.5 78.74,41.27
N$32
  Top 0.254: S8.A1 101.44,39.84 101.6,40.01 101.6,41.27 | 101.6,41.27 101.61,48.12 101.3,47.8 S8.A2 | CN8.1 107.06,41.27 101.6,41.27 | IC2.11 20.32,31.75 20.95,31.11 75.56,31.11 77.47,33.02 98.42,33.02 99.06,33.66 99.06,40.64 99.69,41.27 101.6,41.27
N$33
  Top 0.254: D1.A 34.92,55.88 35.56,56.52 37.78,56.52 R1.2
N$34
  Top 0.254: D2.A 57.78,55.88 58.42,56.52 60.65,56.52 R3.2
N$35
  Top 0.254: D3.A 80.64,55.88 81.28,56.52 83.5,56.52 R5.2
N$36
  Top 0.254: D4.A 103.5,55.88 104.14,56.52 106.36,56.52 R7.2
N$37
  Top 0.254: R9.2 37.78,36.83 35.56,36.83 34.92,36.2 D5.A
N$38
  Top 0.254: D6.A 57.78,36.2 58.42,36.83 60.65,36.83 R11.2
N$39
  Top 0.254: D7.A 80.64,36.2 81.28,36.83 83.5,36.83 R13.2
N$40
  Top 0.254: D8.A 103.5,36.2 104.14,36.83 106.36,36.83 R15.2
N$41
  Top 0.254: CN1.2 R2.2
N$42
  Top 0.254: R1.1 38.42,54.93 38.73,55.24 39.37,55.24 | R2.1 40.33,55.24 39.37,55.24 | IC1.16 20.32,57.15 24.13,53.34 38.73,53.34 39.37,53.98 39.37,55.24
N$43
  Top 0.254: CN2.2 R4.2
N$44
  Top 0.254: CN3.2 R6.2
N$45
  Top 0.254: CN4.2 R8.2
N$46
  Top 0.254: CN5.2 R10.2
N$47
  Top 0.254: CN6.2 R12.2
N$48
  Top 0.254: CN7.2 R14.2
N$49
  Top 0.254: CN8.2 R16.2
N$50
  Top 0.254: R3.1 61.28,54.93 61.59,55.24 62.23,55.24 | R4.1 63.19,55.24 62.23,55.24 | IC1.14 20.32,54.61 22.86,52.07 61.59,52.07 62.23,52.7 62.23,55.24
N$51
  Top 0.254: R5.1 84.14,54.93 84.45,55.24 85.09,55.24 | R6.1 86.05,55.24 85.09,55.24 | IC1.12 20.32,52.07 21.59,50.8 84.45,50.8 85.09,51.44 85.09,55.24
N$52
  Top 0.254: R7.1 107,54.93 107.31,55.24 107.95,55.24 | R8.1 108.91,55.24 107.95,55.24 | IC1.10 107.31,49.53 107.95,50.16 107.95,55.24
N$53
  Top 0.254: R9.1 38.42,35.24 38.73,35.56 | R10.1 40.33,35.56 38.73,35.56 | IC2.16 20.32,38.1 24.13,34.29 35.56,34.29 36.83,35.56 38.73,35.56
N$54
  Top 0.254: R11.1 61.28,35.24 61.59,35.56 62.23,35.56 | R12.1 63.19,35.56 62.23,35.56 | IC2.14 20.32,35.56 22.86,33.02 61.59,33.02 62.23,33.66 62.23,35.56
N$55
  Top 0.254: R13.1 84.14,35.24 84.45,35.56 85.09,35.56 | R14.1 86.05,35.56 85.09,35.56 | IC2.12 20.32,33.02 21.59,31.75 74.93,31.75 76.83,33.66 84.45,33.66 85.09,34.29 85.09,35.56
N$56
  Top 0.254: R15.1 107,35.24 107.31,35.56 107.95,35.56 | R16.1 108.91,35.56 107.95,35.56 | IC2.10 76.2,30.48 78.11,32.38 107.31,32.38 107.95,33.02 107.95,35.56
N$57
  Top 0.254: S10.8 58.42,21.59 59.05,20.95 81.28,20.95 83.82,23.5 93.34,23.5 93.98,24.13 IC6.10
N$58
  Top 0.254: D10.A IC2.8
N$122
  Top 0.254: D9.A IC1.8
N$123
  Top 0.254: IC6.8 92.71,22.23 93.34,22.86 94.61,22.86 95.25,23.5 D15.A
N$125
  Top 0.254: 115.57,22.57 IC7.6
  Top 0.61: C15.2 115.25,24.45 115.57,24.13 115.57,23.5 | 115.57,23.5 115.57,22.57 | L1.1 120.62,23.5 115.57,23.5
N$126
  Top 0.254: 113.03,22.57 IC7.1
  Top 0.61: C15.1 113.35,24.45 113.03,24.13 113.03,22.57
N$127
  Top 0.254: IC7.3 106.68,20.64 | 106.68,20.64 104.45,20.64 103.82,21.27 R27.2 | R28.1 106.68,20.64
RESET  (via drill 0.35)
  Top 0.254: C7.2 15.24,12.38 15.24,10.48 R20.1 15.24,9.84 15.24,8.26 15.88,7.62 17.32,7.62 S9.B1 17.91,7.62 25.4,7.62 25.57,7.46 S9.B2 | X2.5 39.37,5.08 39.37,3.17 38.73,2.54 29.84,2.54 29.21,3.17 29.21,6.99 28.57,7.62 25.86,7.62 S9.B2 | IC3.29 v28.81,24.13 30.48,24.13 31.11,23.5 v31.11,22.23 | v90.17,18.41 IC6.6 | IC1.6 v12.06,53.34 | IC2.6 v12.06,34.29 | S9.B2 25.4,7.5 v25.4,10.79
  Bottom 0.254: v90.17,18.41 90.17,17.78 89.53,17.14 83.19,17.14 82.55,17.78 82.55,22.23 77.47,27.3 42.55,27.3 39.37,24.13 v28.81,24.13 28.81,27.94 28.18,28.57 12.7,28.57 12.06,29.21 v12.06,34.29 v12.06,53.34 | v31.11,22.23 27.94,22.23 25.4,19.68 v25.4,10.79
SPI_CLK
  Top 0.254: 35.56,15.88 X2.3 | IC4.10 44.45,17.14 43.18,15.88 35.56,15.88 | IC3.17 34.92,18.79 35.56,18.16 35.56,15.88
SPI_CS_CAN  (via drill 0.35)
  Top 0.254: IC4.13 40.01,13.34 39.37,12.7 v39.37,9.53 | IC3.14 30.41,11.36 v29.84,10.79
  Bottom 0.254: v39.37,9.53 38.1,10.79 v29.84,10.79
SPI_MISO  (via drill 0.35)
  Top 0.254: IC4.12 37.47,14.61 36.83,13.97 36.83,8.89 v37.47,8.26 | IC3.16 32.01,15.24 32.01,14.76 32.01,7.36 X2.1
  Bottom 0.254: v37.47,8.26 33.66,8.26 33.02,7.62 X2.1
SPI_MOSI
  Top 0.254: IC3.15 31.21,5.62 31.75,5.08 35.56,5.08 | 35.56,5.08 36.2,5.08 36.83,5.71 36.83,6.99 36.2,7.62 36.2,14.61 36.83,15.24 43.81,15.24 44.45,15.88 IC4.11 | X2.4 35.56,5.08
UART_RX
  Top 0.254: X1.4 9.53,17.78 10.16,18.41 10.16,27.94 10.79,28.57 27.38,28.57 28.01,27.94 IC3.30
UART_TX
  Top 0.254: X1.5 10.16,15.24 10.79,15.88 10.79,27.3 11.43,27.94 26.57,27.94 27.21,27.3 IC3.31
VCC  (via drill 0.35, 0.4)
  Top 0.254: 20.23,21.99 C4.1 20,22.54 20.32,22.86 | C3.1 20.32,24.89 | v56.52,3.81 R23.2 | v75.56,3.81 R26.2 | v69.22,3.81 R25.2 | R18.2 4.13,37.15 3.81,36.83 3.81,36.2 | R19.2 3.81,34.92 3.81,36.2 | v1.91,36.2 3.81,36.2 | v1.91,54.61 R17.2
  Top 0.406: IC5.3 83.82,11.43 84.45,10.79 84.45,10.16 | 84.45,10.16 v84.45,8.26 | IC5.5 84.45,10.16 | v84.45,8.26 86.36,8.26 C13.2 | C12.1 82.55,8.26 v84.45,8.26 | 20.23,21.99 IC3.4 26.91,21.99 27.7,21.19 | 27.7,21.19 31.11,21.19 | 31.11,21.19 IC3.20 37.47,21.19 | IC3.6 26.91,20.39 27.7,21.19 | IC3.18 31.84,19.59 31.11,20.32 31.11,21.19 | C3.1 20.32,24.64 20.32,22.86 | 20.32,24.89 v20.32,26.67 | R20.2 12.7,10.16 v12.7,8.26 | R22.2 40.01,21.82 39.37,21.19 37.47,21.19 | R21.1 37.47,21.19 | IC2.18 18.41,40.8 18.41,41.91 | C2.2 18.41,42.87 18.41,41.91 | IC1.18 18.41,59.84 18.41,60.96 | C1.2 18.41,61.91 18.41,60.96 | C11.2 v82.55,29.84 83.67,29.84 IC6.18 | v1.91,41.91 18.41,41.91 | v1.91,60.96 18.41,60.96 | C10.1 v44.45,12.06 IC4.14
  Bottom 0.254: 56.52,1.91 v56.52,3.81 | 75.56,1.91 v75.56,3.81 | 69.22,1.91 v69.22,3.81
  Bottom 0.406: 10.16,8.26 v12.7,8.26 | v82.55,29.84 102.23,29.84 | 84.45,1.91 v84.45,8.26 | 44.45,1.91 v44.45,12.06
  Bottom 0.61: 33.02,1.91 10.79,1.91 10.16,2.54 10.16,8.26 10.16,20.32 | X2.2 33.02,1.91 | 10.16,20.32 X1.3 2.54,20.32 1.91,20.95 v1.91,36.2 v1.91,41.91 v1.91,54.61 v1.91,60.96 | 33.02,1.91 44.45,1.91 56.52,1.91 69.22,1.91 75.56,1.91 84.45,1.91 101.6,1.91 102.23,2.54 v102.23,25.4 v102.23,26.67 v102.23,27.94 v102.23,29.21 102.23,29.84 v102.23,30.48 | 10.16,20.32 10.16,26.04 10.79,26.67 v20.32,26.67
  pour Top (isolate 0.254, no thermals): 100.33,23.75 110.49,23.75 110.49,26.67 111.12,27.3 124.46,27.3 124.46,31.75 100.33,31.75

### Text on the board
bPlace: REMOTE_ILLUMINATED_SWITCH_V0.1 | SW | PIN 1 | LED | PIN 2 | GND | PIN 3